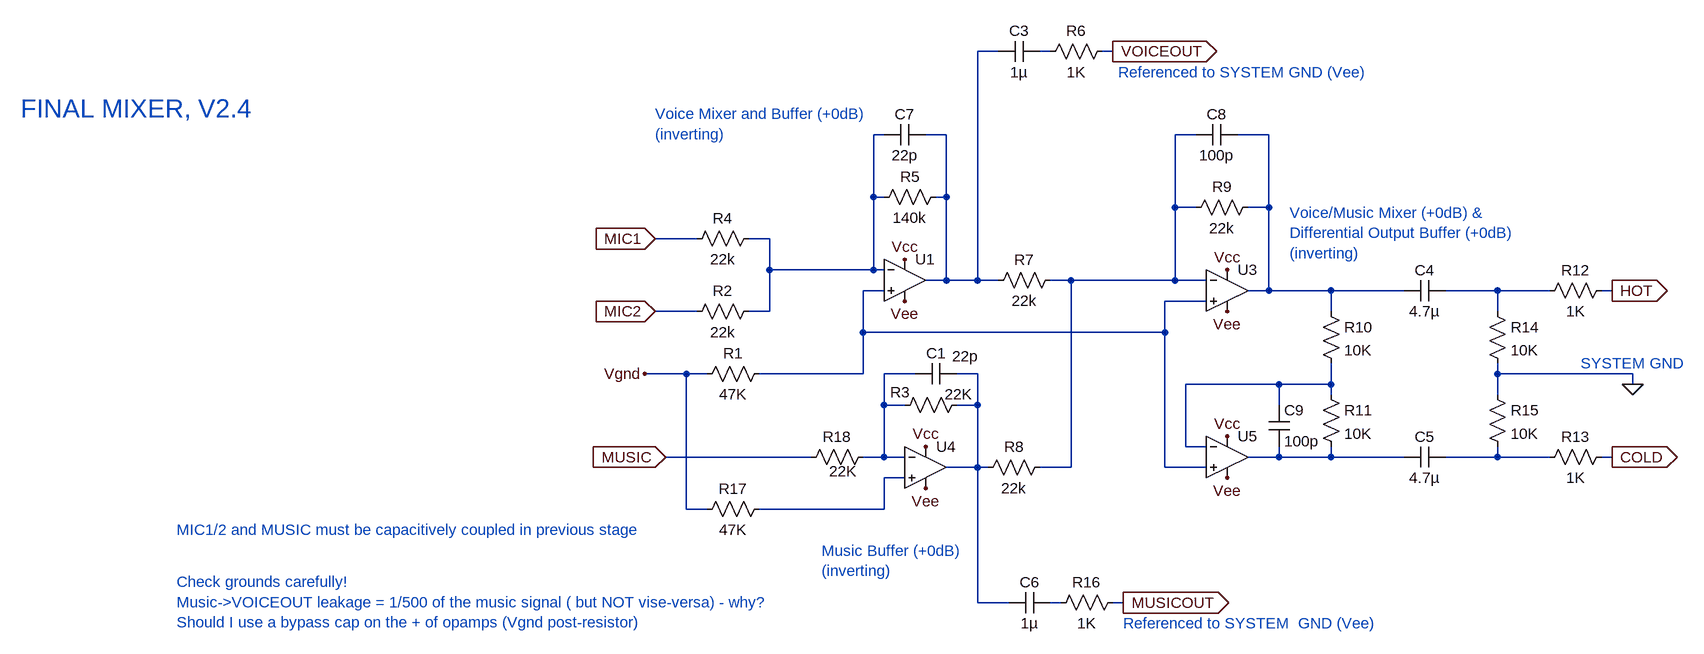
[diagram p0: schematic NewFinalMixer_V2.4.asc]
NewFinalMixer_V2.4.asc, the LTspice schematic file:
Version 4
SHEET 1 2328 836
WIRE 720 -128 688 -128
WIRE 800 -128 784 -128
WIRE 896 -128 880 -128
WIRE 544 0 528 0
WIRE 640 0 608 0
WIRE 1024 0 992 0
WIRE 1136 0 1088 0
WIRE 528 96 528 0
WIRE 544 96 528 96
WIRE 640 96 640 0
WIRE 640 96 624 96
WIRE 992 112 992 0
WIRE 1024 112 992 112
WIRE 1136 112 1136 0
WIRE 1136 112 1104 112
WIRE 256 160 192 160
WIRE 368 160 336 160
WIRE 368 208 368 160
WIRE 528 208 528 96
WIRE 528 208 368 208
WIRE 544 208 528 208
WIRE 640 224 640 96
WIRE 640 224 608 224
WIRE 688 224 688 -128
WIRE 688 224 640 224
WIRE 720 224 688 224
WIRE 832 224 800 224
WIRE 992 224 992 112
WIRE 992 224 832 224
WIRE 1040 224 992 224
WIRE 544 240 512 240
WIRE 1136 240 1136 112
WIRE 1136 240 1104 240
WIRE 1232 240 1136 240
WIRE 1344 240 1232 240
WIRE 1488 240 1408 240
WIRE 1568 240 1488 240
WIRE 1664 240 1648 240
WIRE 1040 256 976 256
WIRE 256 272 192 272
WIRE 368 272 368 208
WIRE 368 272 336 272
WIRE 1232 272 1232 240
WIRE 1488 272 1488 240
WIRE 512 304 512 240
WIRE 976 304 976 256
WIRE 976 304 512 304
WIRE 240 368 176 368
WIRE 272 368 240 368
WIRE 512 368 512 304
WIRE 512 368 352 368
WIRE 592 368 544 368
WIRE 688 368 656 368
WIRE 1488 368 1488 352
WIRE 1696 368 1488 368
WIRE 1152 384 1008 384
WIRE 1232 384 1232 352
WIRE 1232 384 1152 384
WIRE 1696 384 1696 368
WIRE 1232 400 1232 384
WIRE 1488 400 1488 368
WIRE 544 416 544 368
WIRE 576 416 544 416
WIRE 688 416 688 368
WIRE 688 416 656 416
WIRE 1152 416 1152 384
WIRE 1008 480 1008 384
WIRE 1040 480 1008 480
WIRE 432 496 208 496
WIRE 544 496 544 416
WIRE 544 496 512 496
WIRE 576 496 544 496
WIRE 1152 496 1152 480
WIRE 1152 496 1104 496
WIRE 1232 496 1232 480
WIRE 1232 496 1152 496
WIRE 1344 496 1232 496
WIRE 1488 496 1488 480
WIRE 1488 496 1408 496
WIRE 1568 496 1488 496
WIRE 1664 496 1648 496
WIRE 688 512 688 416
WIRE 688 512 640 512
WIRE 704 512 688 512
WIRE 832 512 832 224
WIRE 832 512 784 512
WIRE 976 512 976 304
WIRE 1040 512 976 512
WIRE 576 528 544 528
WIRE 240 576 240 368
WIRE 272 576 240 576
WIRE 544 576 544 528
WIRE 544 576 352 576
WIRE 688 720 688 512
WIRE 736 720 688 720
WIRE 816 720 800 720
WIRE 912 720 896 720
FLAG 576 192 Vcc
FLAG 576 256 Vee
FLAG 896 -128 VOICEOUT
IOPIN 896 -128 Out
FLAG 1072 208 Vcc
FLAG 1072 272 Vee
FLAG 608 480 Vcc
FLAG 608 544 Vee
FLAG 1072 464 Vcc
FLAG 1072 528 Vee
FLAG 1664 240 HOT
IOPIN 1664 240 Out
FLAG 1664 496 COLD
IOPIN 1664 496 Out
FLAG 1696 384 0
FLAG 912 720 MUSICOUT
IOPIN 912 720 Out
FLAG 192 160 MIC1
IOPIN 192 160 In
FLAG 192 272 MIC2
IOPIN 192 272 In
FLAG 208 496 MUSIC
IOPIN 208 496 In
FLAG 176 368 Vgnd
SYMBOL res 352 256 R90
WINDOW 0 0 56 VBottom 2
WINDOW 3 32 56 VTop 2
SYMATTR InstName R2
SYMATTR Value 22k
SYMBOL Opamps/UniversalOpAmp 576 224 R0
SYMATTR InstName U1
SYMATTR Value2 Avol=100K GBW=1Meg Vos=0
SYMBOL res 640 80 R90
WINDOW 0 0 56 VBottom 2
WINDOW 3 32 56 VTop 2
SYMATTR InstName R5
SYMATTR Value 140k
SYMBOL cap 784 -144 R90
WINDOW 0 0 32 VBottom 2
WINDOW 3 32 32 VTop 2
SYMATTR InstName C3
SYMATTR Value 1µ
SYMBOL res 896 -144 R90
WINDOW 0 0 56 VBottom 2
WINDOW 3 32 56 VTop 2
SYMATTR InstName R6
SYMATTR Value 1K
SYMBOL res 816 208 R90
WINDOW 0 0 56 VBottom 2
WINDOW 3 32 56 VTop 2
SYMATTR InstName R7
SYMATTR Value 22k
SYMBOL res 800 496 R90
WINDOW 0 0 56 VBottom 2
WINDOW 3 32 56 VTop 2
SYMATTR InstName R8
SYMATTR Value 22k
SYMBOL Opamps/UniversalOpAmp 1072 240 R0
SYMATTR InstName U3
SYMATTR Value2 Avol=100K GBW=1Meg Vos=0
SYMBOL res 1120 96 R90
WINDOW 0 0 56 VBottom 2
WINDOW 3 32 56 VTop 2
SYMATTR InstName R9
SYMATTR Value 22k
SYMBOL res 1216 256 R0
SYMATTR InstName R10
SYMATTR Value 10K
SYMBOL res 1216 384 R0
SYMATTR InstName R11
SYMATTR Value 10K
SYMBOL Opamps/UniversalOpAmp 608 512 R0
SYMATTR InstName U4
SYMATTR Value2 Avol=100K GBW=1Meg Vos=0
SYMBOL Opamps/UniversalOpAmp 1072 496 R0
SYMATTR InstName U5
SYMATTR Value2 Avol=100K GBW=1Meg Vos=0
SYMBOL cap 1408 224 R90
WINDOW 0 0 32 VBottom 2
WINDOW 3 32 32 VTop 2
SYMATTR InstName C4
SYMATTR Value 4.7µ
SYMBOL res 1664 224 R90
WINDOW 0 0 56 VBottom 2
WINDOW 3 32 56 VTop 2
SYMATTR InstName R12
SYMATTR Value 1K
SYMBOL cap 1408 480 R90
WINDOW 0 0 32 VBottom 2
WINDOW 3 32 32 VTop 2
SYMATTR InstName C5
SYMATTR Value 4.7µ
SYMBOL res 1664 480 R90
WINDOW 0 0 56 VBottom 2
WINDOW 3 32 56 VTop 2
SYMATTR InstName R13
SYMATTR Value 1K
SYMBOL res 1472 256 R0
SYMATTR InstName R14
SYMATTR Value 10K
SYMBOL res 1472 384 R0
SYMATTR InstName R15
SYMATTR Value 10K
SYMBOL cap 800 704 R90
WINDOW 0 0 32 VBottom 2
WINDOW 3 32 32 VTop 2
SYMATTR InstName C6
SYMATTR Value 1µ
SYMBOL res 912 704 R90
WINDOW 0 0 56 VBottom 2
WINDOW 3 32 56 VTop 2
SYMATTR InstName R16
SYMATTR Value 1K
SYMBOL cap 608 -16 R90
WINDOW 0 0 32 VBottom 2
WINDOW 3 32 32 VTop 2
SYMATTR InstName C7
SYMATTR Value 22p
SYMBOL cap 1088 -16 R90
WINDOW 0 0 32 VBottom 2
WINDOW 3 32 32 VTop 2
SYMATTR InstName C8
SYMATTR Value 100p
SYMBOL cap 1136 416 R0
SYMATTR InstName C9
SYMATTR Value 100p
SYMBOL res 352 144 R90
WINDOW 0 0 56 VBottom 2
WINDOW 3 32 56 VTop 2
SYMATTR InstName R4
SYMATTR Value 22k
SYMBOL res 368 560 R90
WINDOW 0 0 56 VBottom 2
WINDOW 3 32 56 VTop 2
SYMATTR InstName R17
SYMATTR Value 47K
SYMBOL res 368 352 R90
WINDOW 0 0 56 VBottom 2
WINDOW 3 32 56 VTop 2
SYMATTR InstName R1
SYMATTR Value 47K
SYMBOL res 672 400 R90
WINDOW 0 12 103 VBottom 2
WINDOW 3 -16 13 VTop 2
SYMATTR InstName R3
SYMATTR Value 22K
SYMBOL res 528 480 R90
WINDOW 0 0 56 VBottom 2
WINDOW 3 22 47 VTop 2
SYMATTR InstName R18
SYMATTR Value 22K
SYMBOL cap 656 352 R90
WINDOW 0 0 32 VBottom 2
WINDOW 3 -27 -13 VTop 2
SYMATTR InstName C1
SYMATTR Value 22p
TEXT -544 688 Left 2 ;Check grounds carefully!\nMusic->VOICEOUT leakage = 1/500 of the music signal ( but NOT vise-versa) - why?\nShould I use a bypass cap on the + of opamps (Vgnd post-resistor)
TEXT 904 -96 Left 2 ;Referenced to SYSTEM GND (Vee)
TEXT 912 752 Left 2 ;Referenced to SYSTEM  GND (Vee)
TEXT 192 -32 Left 2 ;Voice Mixer and Buffer (+0dB)\n(inverting)
TEXT 448 640 Left 2 ;Music Buffer (+0dB)\n(inverting)
TEXT 1168 120 Left 2 ;Voice/Music Mixer (+0dB) &\nDifferential Output Buffer (+0dB)\n(inverting)
TEXT 1616 352 Left 2 ;SYSTEM GND
TEXT -544 608 Left 2 ;MIC1/2 and MUSIC must be capacitively coupled in previous stage
TEXT -784 -40 Left 4 ;FINAL MIXER, V2.4

The netlist it stands for:
* NewFinalMixer_V2.4.asc
R2 N003 MIC2 22k
XU1 N006 N003 Vcc Vee N001 level1 Avol=100K GBW=1Meg Vos=0 En=0 Enk=0 In=0 Ink=0 Rin=500Meg  ; pins In+ In- V+ V- OUT
R5 N001 N003 140k
C3 N002 N001 1µ
R6 VOICEOUT N002 1K
R7 N004 N001 22k
R8 N004 N009 22k
XU3 N006 N004 Vcc Vee N005 level1 Avol=100K GBW=1Meg Vos=0 En=0 Enk=0 In=0 Ink=0 Rin=500Meg  ; pins In+ In- V+ V- OUT
R9 N005 N004 22k
R10 N005 N010 10K
R11 N010 N011 10K
XU4 N013 N008 Vcc Vee N009 level1 Avol=100K GBW=1Meg Vos=0 En=0 Enk=0 In=0 Ink=0 Rin=500Meg  ; pins In+ In- V+ V- OUT
XU5 N006 N010 Vcc Vee N011 level1 Avol=100K GBW=1Meg Vos=0 En=0 Enk=0 In=0 Ink=0 Rin=500Meg  ; pins In+ In- V+ V- OUT
C4 N007 N005 4.7µ
R12 HOT N007 1K
C5 N012 N011 4.7µ
R13 COLD N012 1K
R14 N007 0 10K
R15 0 N012 10K
C6 N014 N009 1µ
R16 MUSICOUT N014 1K
C7 N001 N003 22p
C8 N005 N004 100p
C9 N010 N011 100p
R4 N003 MIC1 22k
R17 N013 Vgnd 47K
R1 N006 Vgnd 47K
R3 N009 N008 22K
R18 N008 MUSIC 22K
C1 N009 N008 22p
* Check grounds carefully!
* Music->VOICEOUT leakage = 1/500 of the music signal ( but NOT vise-versa) - why?
* Should I use a bypass cap on the + of opamps (Vgnd post-resistor)
* Referenced to SYSTEM GND (Vee)
* Referenced to SYSTEM  GND (Vee)
* Voice Mixer and Buffer (+0dB)
* (inverting)
* Music Buffer (+0dB)
* (inverting)
* Voice/Music Mixer (+0dB) &
* Differential Output Buffer (+0dB)
* (inverting)
* SYSTEM GND
* MIC1/2 and MUSIC must be capacitively coupled in previous stage
* FINAL MIXER, V2.4
.lib UniversalOpAmp1.lib
.backanno
.end